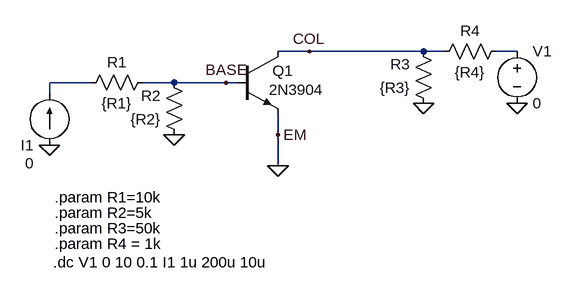
[diagram p0: schematic Draft1.asc]
Draft1.asc, the LTspice schematic file:
Version 4
SHEET 1 880 680
WIRE 288 112 240 112
WIRE 464 112 288 112
WIRE 496 112 464 112
WIRE 608 112 576 112
WIRE -48 160 -112 160
WIRE 80 160 32 160
WIRE 160 160 80 160
WIRE 176 160 160 160
WIRE -112 176 -112 160
WIRE 240 240 240 208
WIRE 240 288 240 240
FLAG 80 240 0
FLAG -112 256 0
FLAG 464 192 0
FLAG 608 192 0
FLAG 240 288 0
FLAG 240 240 EM
FLAG 288 112 COL
FLAG 160 160 BASE
SYMBOL res 48 144 R90
WINDOW 0 0 56 VBottom 2
WINDOW 3 32 56 VTop 2
SYMATTR InstName R1
SYMATTR Value {R1}
SYMBOL res 96 256 R180
WINDOW 0 36 76 Left 2
WINDOW 3 36 40 Left 2
SYMATTR InstName R2
SYMATTR Value {R2}
SYMBOL res 480 208 R180
WINDOW 0 36 76 Left 2
WINDOW 3 36 40 Left 2
SYMATTR InstName R3
SYMATTR Value {R3}
SYMBOL res 480 128 R270
WINDOW 0 32 56 VTop 2
WINDOW 3 0 56 VBottom 2
SYMATTR InstName R4
SYMATTR Value {R4}
SYMBOL voltage 608 96 R0
WINDOW 123 0 0 Left 0
WINDOW 39 0 0 Left 0
SYMATTR InstName V1
SYMATTR Value 0
SYMBOL npn 176 112 R0
WINDOW 0 55 30 Left 2
WINDOW 3 50 59 Left 2
SYMATTR InstName Q1
SYMATTR Value 2N3904
SYMBOL current -112 256 R180
WINDOW 3 24 -28 Left 2
WINDOW 123 0 0 Left 0
WINDOW 39 0 0 Left 0
SYMATTR InstName I1
SYMATTR Value 0
TEXT -104 336 Left 2 !.param R1=10k
TEXT -104 360 Left 2 !.param R2=5k
TEXT -104 384 Left 2 !.param R3=50k
TEXT -104 408 Left 2 !.param R4 = 1k
TEXT -106 436 Left 2 !.dc V1 0 10 0.1 I1 1u 200u 10u

The netlist it stands for:
* Draft1.asc
R1 BASE N002 {R1}
R2 0 BASE {R2}
R3 0 COL {R3}
R4 COL N001 {R4}
V1 N001 0 0
Q1 COL BASE 0 0 2N3904
I1 0 N002 0
.model NPN NPN
.model PNP PNP
.lib standard.bjt
.param R1=10k
.param R2=5k
.param R3=50k
.param R4 = 1k
.dc V1 0 10 0.1 I1 1u 200u 10u
.backanno
.end